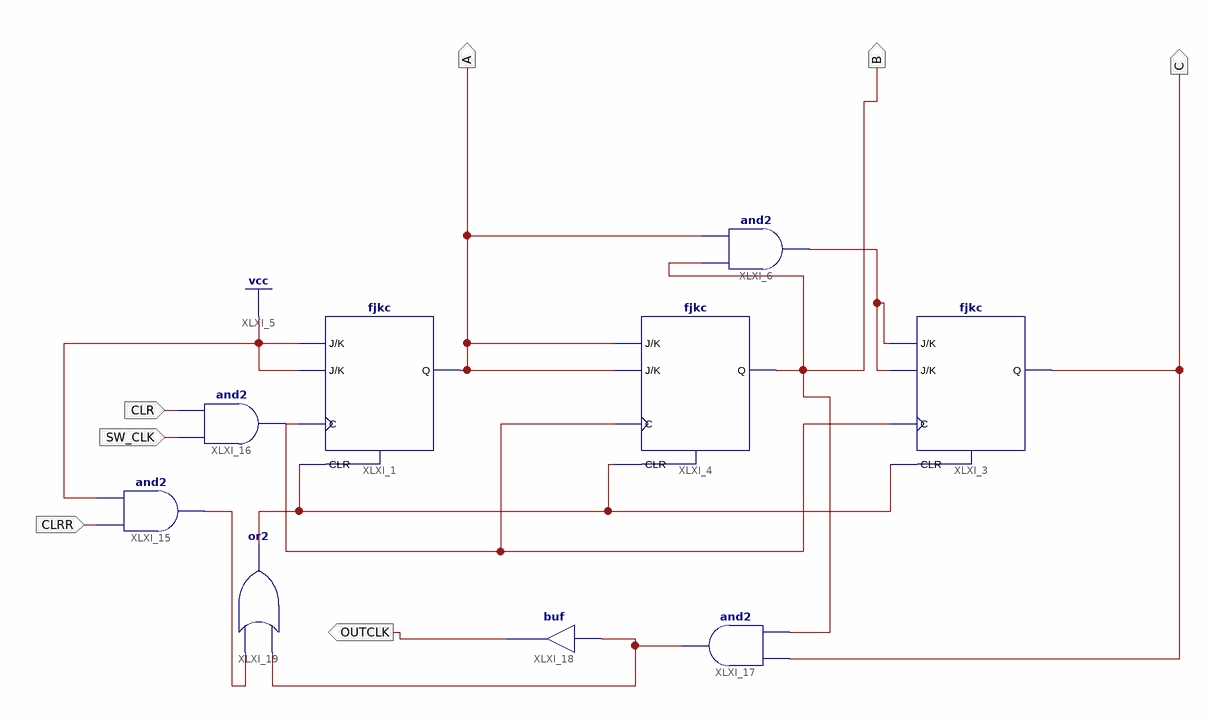
[diagram p0: schematic sheet 1]
// Xilinx ISE schematic SyncCounter1to6.sch (spartan6) as structural Verilog: 9 symbols, 7 ports
module SyncCounter1to6 (
  input  CLR,
  input  SW_CLK,
  input  CLRR,
  output A,
  output B,
  output C,
  output OUTCLK
);

  wire XLXN_13, XLXN_16, XLXN_24, XLXN_25;

  fjkc XLXI_1 (.C(XLXN_13), .CLR(XLXN_16), .J(1'b1), .K(1'b1), .Q(A));
  fjkc XLXI_3 (.C(XLXN_13), .CLR(XLXN_16), .J(B), .K(B), .Q(C));
  fjkc XLXI_4 (.C(XLXN_13), .CLR(XLXN_16), .J(A), .K(A), .Q(B));
  and XLXI_6 (B, B, A);
  and XLXI_15 (XLXN_24, CLRR, 1'b1);
  and XLXI_16 (XLXN_13, SW_CLK, CLR);
  and XLXI_17 (XLXN_25, B, C);
  buf XLXI_18 (OUTCLK, XLXN_25);
  or XLXI_19 (XLXN_16, XLXN_25, XLXN_24);
endmodule
